# Altium schematic sheet BreadBoard.SchDoc
size 190 x 203 mm; SheetNumber: 7; SheetTotal: 15
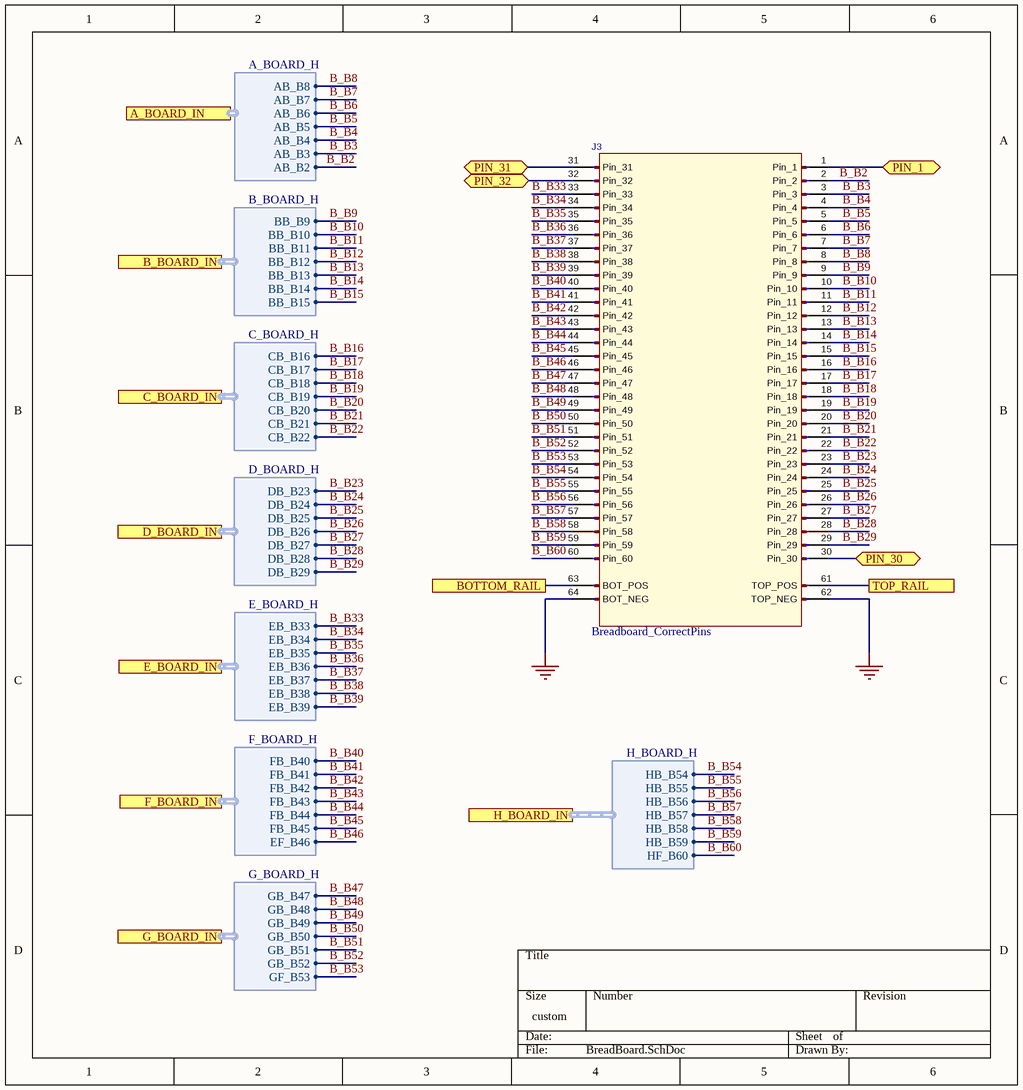
[diagram p0: BreadBoard.SchDoc]

## Parts
J3  Breadboard_CorrectPins  [Breadboard_CustomClips_CorrectPins_1]

## Ports
A_BOARD_IN (harness A_BOARD_H), B_BOARD_IN (harness B_BOARD_H), BOTTOM_RAIL, C_BOARD_IN (harness C_BOARD_H), D_BOARD_IN (harness D_BOARD_H), E_BOARD_IN (harness E_BOARD_H), F_BOARD_IN (harness F_BOARD_H), G_BOARD_IN (harness G_BOARD_H), H_BOARD_IN (harness H_BOARD_H), PIN_1 (bidir), PIN_30 (bidir), PIN_31 (bidir), PIN_32 (bidir), TOP_RAIL

## Harnesses
A_BOARD_H: AB_B2, AB_B3, AB_B4, AB_B5, AB_B6, AB_B7, AB_B8
B_BOARD_H: BB_B10, BB_B11, BB_B12, BB_B13, BB_B14, BB_B15, BB_B9
C_BOARD_H: CB_B16, CB_B17, CB_B18, CB_B19, CB_B20, CB_B21, CB_B22
D_BOARD_H: DB_B23, DB_B24, DB_B25, DB_B26, DB_B27, DB_B28, DB_B29
E_BOARD_H: EB_B33, EB_B34, EB_B35, EB_B36, EB_B37, EB_B38, EB_B39
F_BOARD_H: EF_B46, FB_B40, FB_B41, FB_B42, FB_B43, FB_B44, FB_B45
G_BOARD_H: GB_B47, GB_B48, GB_B49, GB_B50, GB_B51, GB_B52, GF_B53
H_BOARD_H: HB_B54, HB_B55, HB_B56, HB_B57, HB_B58, HB_B59, HF_B60

## Nets
GND: J3.62(TOP_NEG) J3.64(BOT_NEG)
B_B2: J3.2(Pin_2) ; port A_BOARD_IN.AB_B2
B_B3: J3.3(Pin_3) ; port A_BOARD_IN.AB_B3
B_B4: J3.4(Pin_4) ; port A_BOARD_IN.AB_B4
B_B5: J3.5(Pin_5) ; port A_BOARD_IN.AB_B5
B_B6: J3.6(Pin_6) ; port A_BOARD_IN.AB_B6
B_B7: J3.7(Pin_7) ; port A_BOARD_IN.AB_B7
B_B8: J3.8(Pin_8) ; port A_BOARD_IN.AB_B8
B_B9: J3.9(Pin_9) ; port B_BOARD_IN.BB_B9
B_B10: J3.10(Pin_10) ; port B_BOARD_IN.BB_B10
B_B11: J3.11(Pin_11) ; port B_BOARD_IN.BB_B11
B_B12: J3.12(Pin_12) ; port B_BOARD_IN.BB_B12
B_B13: J3.13(Pin_13) ; port B_BOARD_IN.BB_B13
B_B14: J3.14(Pin_14) ; port B_BOARD_IN.BB_B14
B_B15: J3.15(Pin_15) ; port B_BOARD_IN.BB_B15
B_B16: J3.16(Pin_16) ; port C_BOARD_IN.CB_B16
B_B17: J3.17(Pin_17) ; port C_BOARD_IN.CB_B17
B_B18: J3.18(Pin_18) ; port C_BOARD_IN.CB_B18
B_B19: J3.19(Pin_19) ; port C_BOARD_IN.CB_B19
B_B20: J3.20(Pin_20) ; port C_BOARD_IN.CB_B20
B_B21: J3.21(Pin_21) ; port C_BOARD_IN.CB_B21
B_B22: J3.22(Pin_22) ; port C_BOARD_IN.CB_B22
B_B23: J3.23(Pin_23) ; port D_BOARD_IN.DB_B23
B_B24: J3.24(Pin_24) ; port D_BOARD_IN.DB_B24
B_B25: J3.25(Pin_25) ; port D_BOARD_IN.DB_B25
B_B26: J3.26(Pin_26) ; port D_BOARD_IN.DB_B26
B_B27: J3.27(Pin_27) ; port D_BOARD_IN.DB_B27
B_B28: J3.28(Pin_28) ; port D_BOARD_IN.DB_B28
B_B29: J3.29(Pin_29) ; port D_BOARD_IN.DB_B29
B_B33: J3.33(Pin_33) ; port E_BOARD_IN.EB_B33
B_B34: J3.34(Pin_34) ; port E_BOARD_IN.EB_B34
B_B35: J3.35(Pin_35) ; port E_BOARD_IN.EB_B35
B_B36: J3.36(Pin_36) ; port E_BOARD_IN.EB_B36
B_B37: J3.37(Pin_37) ; port E_BOARD_IN.EB_B37
B_B38: J3.38(Pin_38) ; port E_BOARD_IN.EB_B38
B_B39: J3.39(Pin_39) ; port E_BOARD_IN.EB_B39
B_B40: J3.40(Pin_40) ; port F_BOARD_IN.FB_B40
B_B41: J3.41(Pin_41) ; port F_BOARD_IN.FB_B41
B_B42: J3.42(Pin_42) ; port F_BOARD_IN.FB_B42
B_B43: J3.43(Pin_43) ; port F_BOARD_IN.FB_B43
B_B44: J3.44(Pin_44) ; port F_BOARD_IN.FB_B44
B_B45: J3.45(Pin_45) ; port F_BOARD_IN.FB_B45
B_B46: J3.46(Pin_46) ; port F_BOARD_IN.EF_B46
B_B47: J3.47(Pin_47) ; port G_BOARD_IN.GB_B47
B_B48: J3.48(Pin_48) ; port G_BOARD_IN.GB_B48
B_B49: J3.49(Pin_49) ; port G_BOARD_IN.GB_B49
B_B50: J3.50(Pin_50) ; port G_BOARD_IN.GB_B50
B_B51: J3.51(Pin_51) ; port G_BOARD_IN.GB_B51
B_B52: J3.52(Pin_52) ; port G_BOARD_IN.GB_B52
B_B53: J3.53(Pin_53) ; port G_BOARD_IN.GF_B53
B_B54: J3.54(Pin_54) ; port H_BOARD_IN.HB_B54
B_B55: J3.55(Pin_55) ; port H_BOARD_IN.HB_B55
B_B56: J3.56(Pin_56) ; port H_BOARD_IN.HB_B56
B_B57: J3.57(Pin_57) ; port H_BOARD_IN.HB_B57
B_B58: J3.58(Pin_58) ; port H_BOARD_IN.HB_B58
B_B59: J3.59(Pin_59) ; port H_BOARD_IN.HB_B59
B_B60: J3.60(Pin_60) ; port H_BOARD_IN.HF_B60
BOTTOM_RAIL: J3.63(BOT_POS) ; port BOTTOM_RAIL
PIN_1: J3.1(Pin_1) ; port PIN_1
PIN_30: J3.30(Pin_30) ; port PIN_30
PIN_31: J3.31(Pin_31) ; port PIN_31
PIN_32: J3.32(Pin_32) ; port PIN_32
TOP_RAIL: J3.61(TOP_POS) ; port TOP_RAIL